# Altium schematic sheet STM32WB55.SchDoc: HB+SPO2 | STM
size A4; DocumentNumber: 3; Revision: 2; SheetNumber: 3; SheetTotal: 4
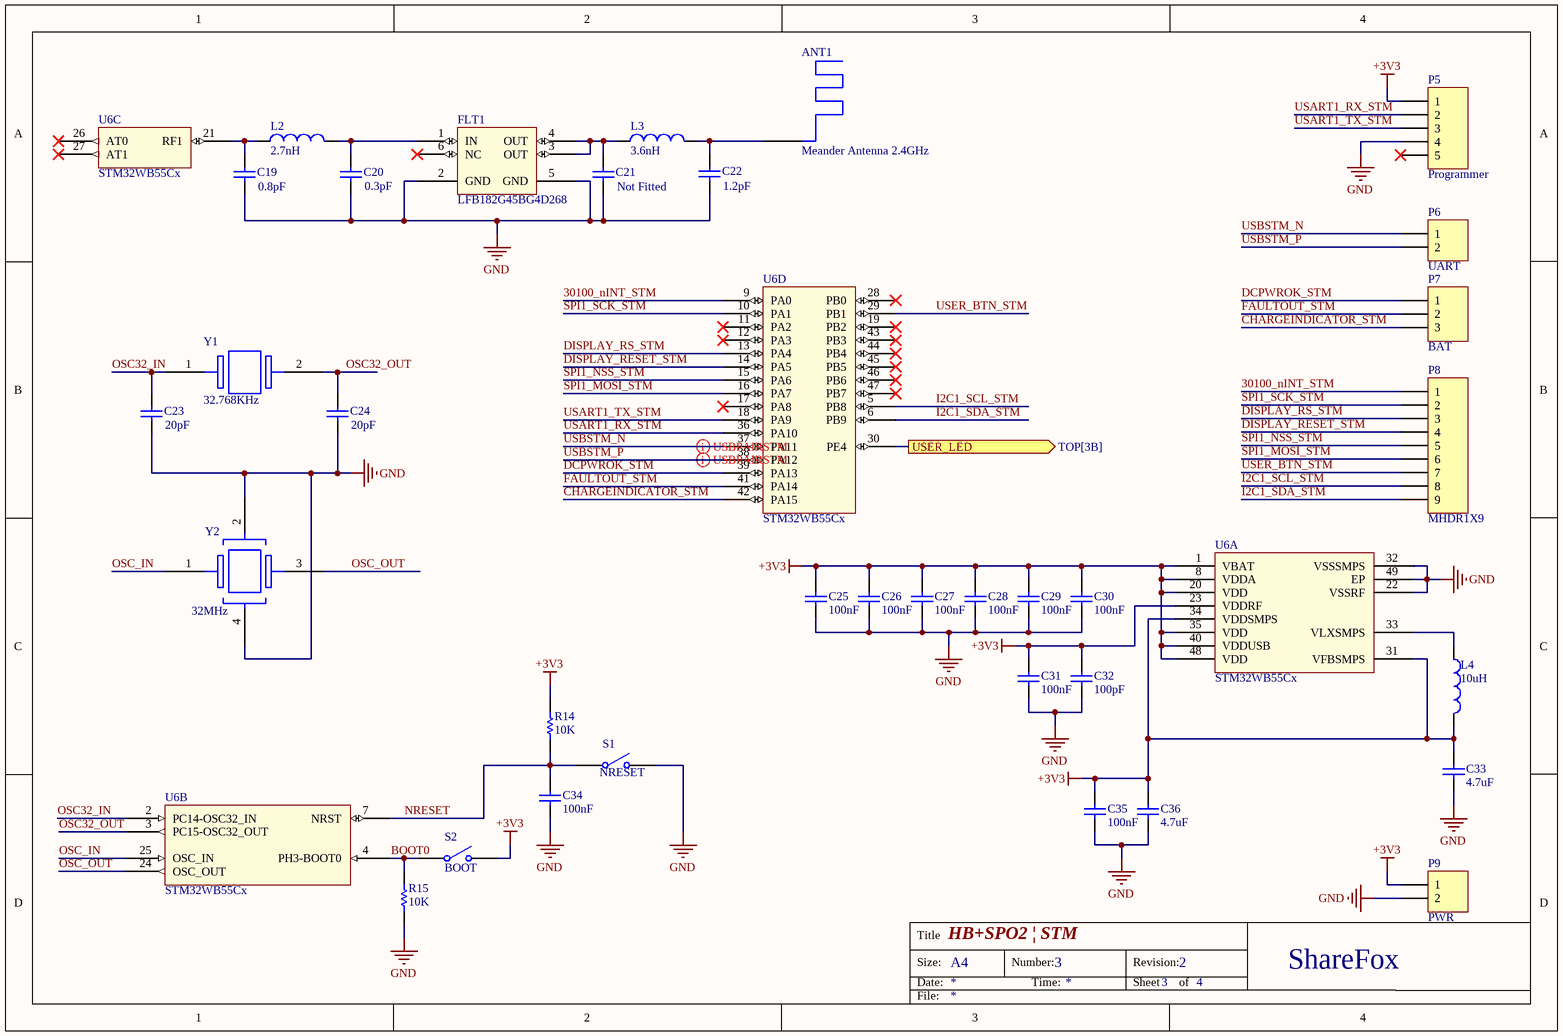
[diagram p0: STM32WB55.SchDoc]

## Parts
ANT1  Meander Antenna 2.4GHz  [Meander2.4G]
C19  0.8pF  [C_0603]
C20  0.3pF  [C_0603]
C21  Not Fitted  [C_0603]
C22  1.2pF  [C_0603]
C23  20pF  [C_0603]
C24  20pF  [C_0603]
C25  100nF  [C_0603]
C26  100nF  [C_0603]
C27  100nF  [C_0603]
C28  100nF  [C_0603]
C29  100nF  [C_0603]
C30  100nF  [C_0603]
C31  100nF  [C_0603]
C32  100pF  [C_0603]
C33  4.7uF  [C_1206]
C34  100nF  [C_0603]
C35  100nF  [C_0603]
C36  4.7uF  [C_1206]
FLT1  LFB182G45BG4D268  [LFB182G45BG4D268]
L2  2.7nH  [L-0603]
L3  3.6nH  [L-0603]
L4  10uH  [L-0603]
P5  Programmer  [HDR1X5]
P6  UART  [MHDR1X2]
P7  BAT  [MHDR1X3]
P8  MHDR1X9  [MHDR1X9]
P9  PWR  [MHDR1X2]
R14  10K  [C_0603]
R15  10K  [C_0603]
S1  NRESET  [B3U-1000P-B]
S2  BOOT  [B3U-1000P-B]
U6  STM32WB55Cx  [QFN48P50S700x700EP560x560]  (parts A,B,C,D of 4)
Y1  32.768KHz  [ECX-31B]
Y2  32MHz  [Y_3225]

## Ports
USER_LED (out, see TOP[3B])

## Nets
+3V3: C25.2 C26.2 C27.2 C28.2 C29.2 C30.2 C31.2 C32.2 C33.2 C35.2 C36.2 L4.2 P5.1 P9.1 R14.1 S2.2(NO) U6.1(VBAT) U6.8(VDDA) U6.20(VDD) U6.23(VDDRF) U6.31(VFBSMPS) U6.34(VDDSMPS) U6.35(VDD) U6.40(VDDUSB) U6.48(VDD)
GND: C19.1 C20.1 C21.1 C22.1 C23.1 C24.1 C25.1 C26.1 C27.1 C28.1 C29.1 C30.1 C31.1 C32.1 C33.1 C34.2 C35.1 C36.1 FLT1.2(GND) FLT1.5(GND) P5.4 P9.2 R15.1 S1.2(NO) U6.22(VSSRF) U6.32(VSSSMPS) U6.49(EP) Y2.2 Y2.4
30100_nINT_STM: P8.1 U6.9(PA0)
BOOT0: R15.2 S2.1(COMMON) U6.4(PH3-BOOT0)
CHARGEINDICATOR_STM: P7.3 U6.42(PA15)
DCPWROK_STM: P7.1 U6.39(PA13)
DISPLAY_RESET_STM: P8.4 U6.14(PA5)
DISPLAY_RS_STM: P8.3 U6.13(PA4)
FAULTOUT_STM: P7.2 U6.41(PA14)
I2C1_SCL_STM: P8.8 U6.5(PB8)
I2C1_SDA_STM: P8.9 U6.6(PB9)
NRESET: C34.1 R14.2 S1.1(COMMON) U6.7(NRST)
OSC32_IN: C23.2 U6.2(PC14-OSC32_IN) Y1.1
OSC32_OUT: C24.2 U6.3(PC15-OSC32_OUT) Y1.2
OSC_IN: U6.25(OSC_IN) Y2.1
OSC_OUT: U6.24(OSC_OUT) Y2.3
SPI1_MOSI_STM: P8.6 U6.16(PA7)
SPI1_NSS_STM: P8.5 U6.15(PA6)
SPI1_SCK_STM: P8.2 U6.10(PA1)
USART1_RX_STM: P5.2 U6.36(PA10)
USART1_TX_STM: P5.3 U6.18(PA9)
USBSTM_N: P6.1 U6.37(PA11)
USBSTM_P: P6.2 U6.38(PA12)
USER_BTN_STM: P8.7 U6.29(PB1)
USER_LED: U6.30(PE4) ; port USER_LED
NetANT1_1: ANT1.1 C22.2 L3.2
NetC19_2: C19.2 L2.1 U6.21(RF1)
NetC20_2: C20.2 FLT1.1(IN) L2.2
NetC21_2: C21.2 FLT1.3(OUT) FLT1.4(OUT) L3.1
NetL4_1: L4.1 U6.33(VLXSMPS)

Not connected (* = marked no-connect by the designer): FLT1 6(NC)*; P5 5*; U6 11(PA2)* 12(PA3)* 17(PA8)* 19(PB2)* 26(AT0)* 27(AT1)* 28(PB0)* 43(PB3)* 44(PB4)* 45(PB5)* 46(PB6)* 47(PB7)*

## Layout directives
differential pair: USBSTM_N, USBSTM_P

## Notes on the sheet
- Title
- Size:
- Date:
- A4
- Number:
- Time:
- Revision:
- Sheet
- of
- ShareFox
- File:

## Library data of the parts
ANT1 = Meander Antenna 2.4GHz: PCB TRACE / DONT TRY TO LOOK FOR PARTS
C19-C36 = Cap: Capacitor; Published: 8-Jun-2000; LatestRevisionDate: 17-Jul-2002; LatestRevisionNote: Re-released for DXP Platform.; PackageReference: RAD-0.3; Publisher: Altium Limited; PackageDescription: Radial Cap, Thru-Hole; 2 Leads; 0.3 in Pin Spacing
  C19: Value: 0.8pF
  C20: Value: 0.3pF
  C21: Value: Not Fitted
  C22: Value: 1.2pF
  C23 C24: Value: 20pF
  C25-C31 C34 C35: Value: 100nF
  C32: Value: 100pF
  C33 C36: Value: 4.7uF
FLT1 = LFB182G45BG4D268: Ultra-small, low-profiled, lightweight band-pass filters.
L2-L4 = Inductor: Code_IEC: 1005; Published: 8-Jun-2000; LatestRevisionDate: 29-May-2009; LatestRevisionNote: IPC-7351 Footprint Added.; PackageReference: 0402-A; Publisher: Altium Limited; PackageDescription: Chip Inductor; Code_JEITA: 0402
  L2: Value: 2.7nH
  L3: Value: 3.6nH
  L4: Value: 10uH
P5 = MHDR1X5: Header, 5-Pin; LatestRevisionDate: 17-Jul-2002; LatestRevisionNote: Re-released for DXP Platform.; Publisher: Altium Limited
P6 P9 = MHDR1X2: Header, 2-Pin; LatestRevisionDate: 17-Jul-2002; LatestRevisionNote: Re-released for DXP Platform.; Publisher: Altium Limited
P7 = MHDR1X3: Header, 3-Pin; LatestRevisionDate: 17-Jul-2002; LatestRevisionNote: Re-released for DXP Platform.; Publisher: Altium Limited
P8 = MHDR1X9: Header, 9-Pin; LatestRevisionDate: 17-Jul-2002; LatestRevisionNote: Re-released for DXP Platform.; Publisher: Altium Limited
R14 R15 = Res1: Resistor; Published: 8-Jun-2000; LatestRevisionDate: 17-Jul-2002; LatestRevisionNote: Re-released for DXP Platform.; PackageReference: AXIAL-0.3; Publisher: Altium Limited; PackageDescription: Axial Device, Thru-Hole; 2 Leads; 0.3 in Pin Spacing; Value: 10K
S1 S2 = SW-SPST: Single-Pole, Single-Throw Switch; Published: 24-Mar-1999; LatestRevisionDate: 17-Jul-2002; LatestRevisionNote: Re-released for DXP Platform.; PackageReference: SPST-2; Publisher: Altium Limited; PackageDescription: Switch; 2 Leads
U6 = STM32WB55Cx: Multiprotocol wireless 32-bit MCU Arm®-based Cortex®-M4 with FPU, Bluetooth® 5 and 802.15.4 radio solution
Y1 = XTAL 3215
Y2 = XTAL 3225 2_4GND